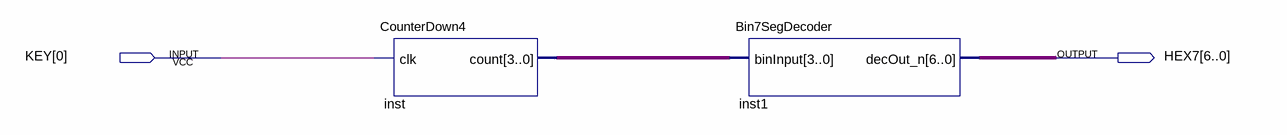
[diagram p0: schematic sheet]
// Quartus schematic Counter_Demo2.bdf as structural Verilog: 2 symbols, 2 pins
module Counter_Demo2 (
  input  [0:0] KEY,
  output [6:0] HEX7
);

  wire [3:0] inst_count;

  CounterDown4 inst (.clk(KEY[0]), .count(inst_count));
  Bin7SegDecoder inst1 (.binInput(inst_count), .decOut_n(HEX7));
endmodule
